# EAGLE board front-panel-controller (EAGLE 5.11)
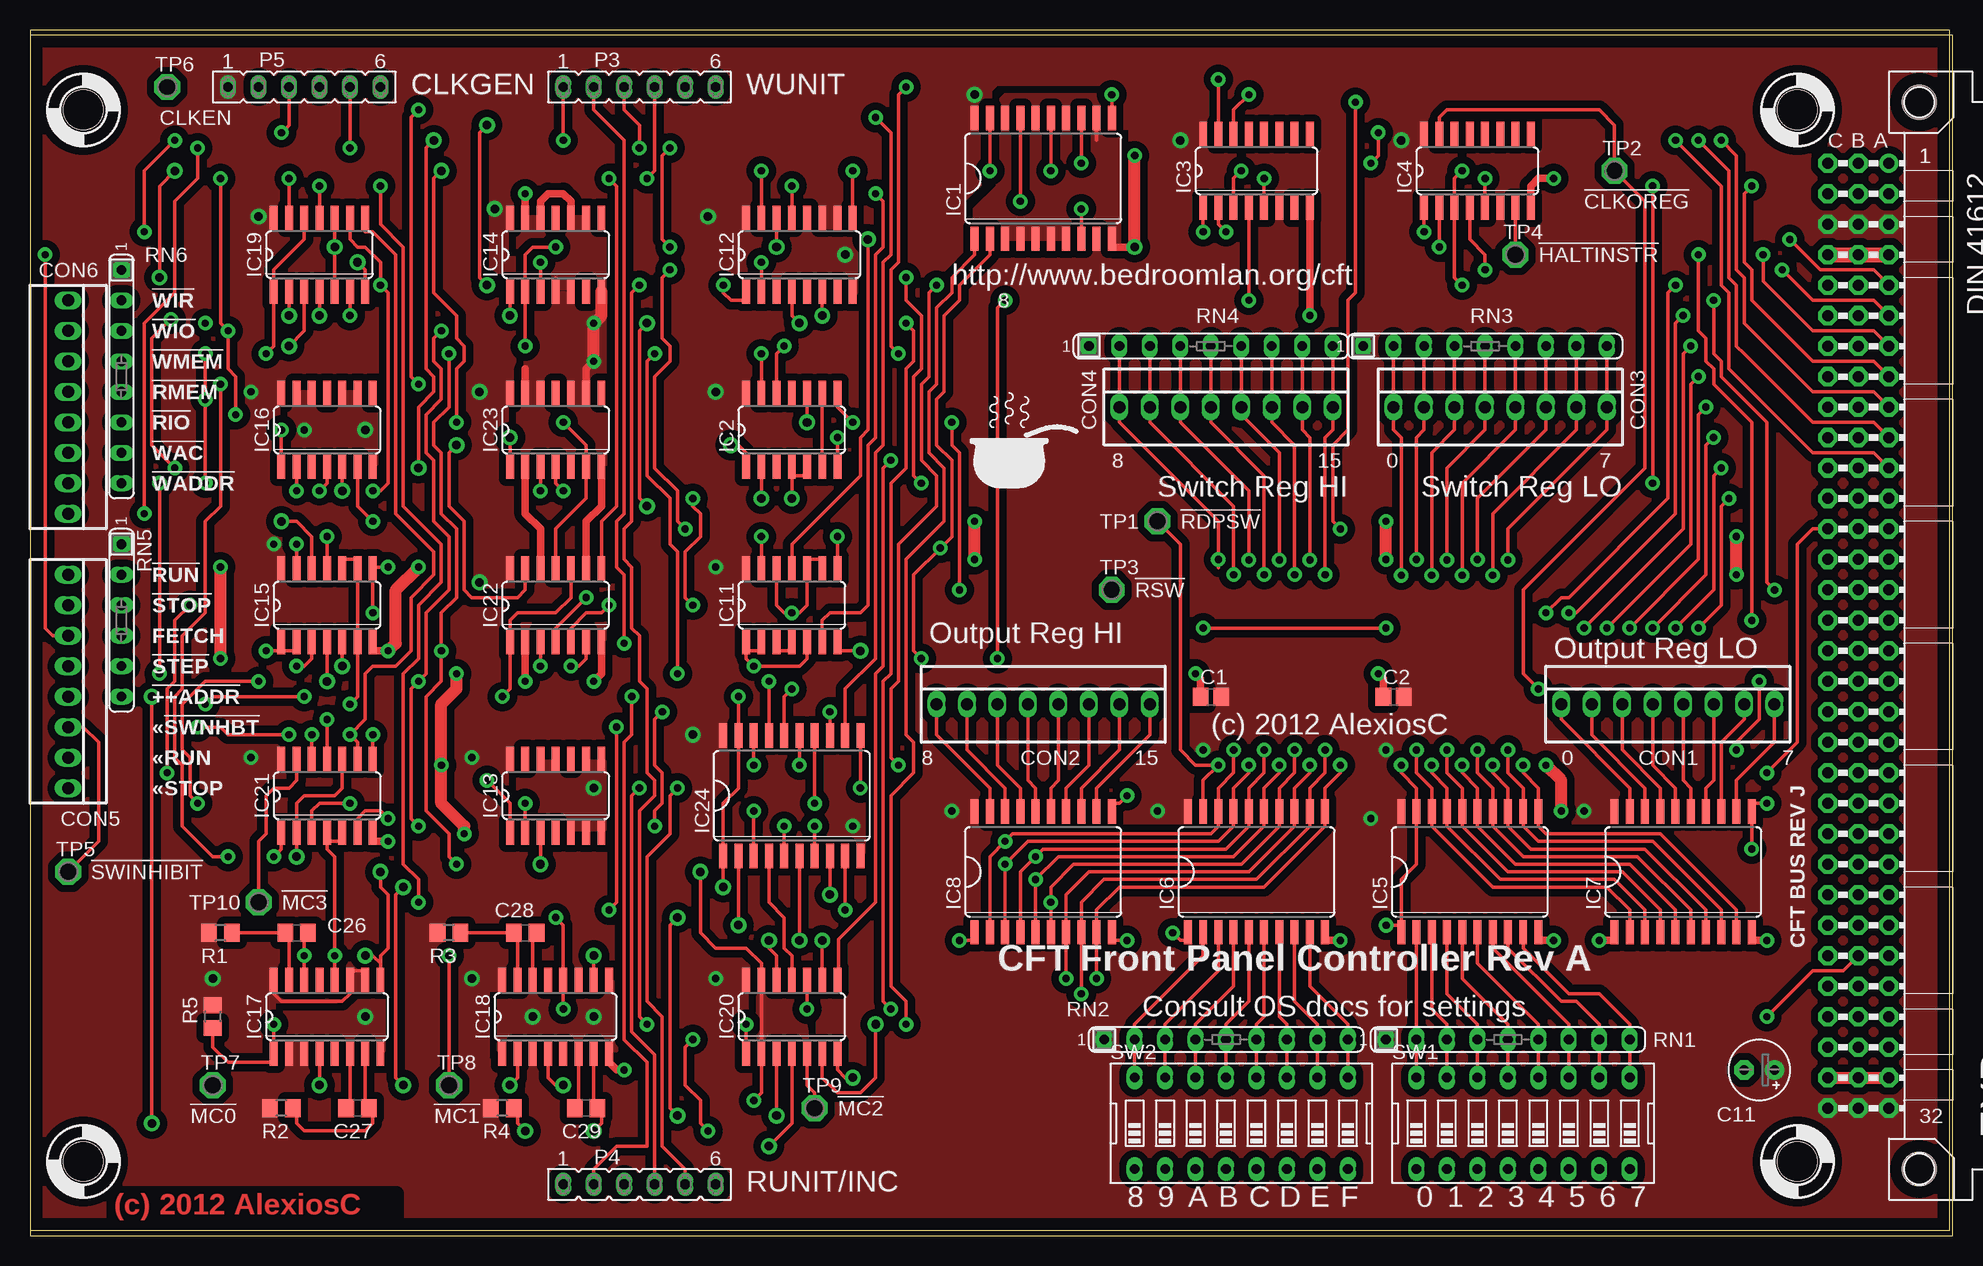
[diagram p4: board, top side]
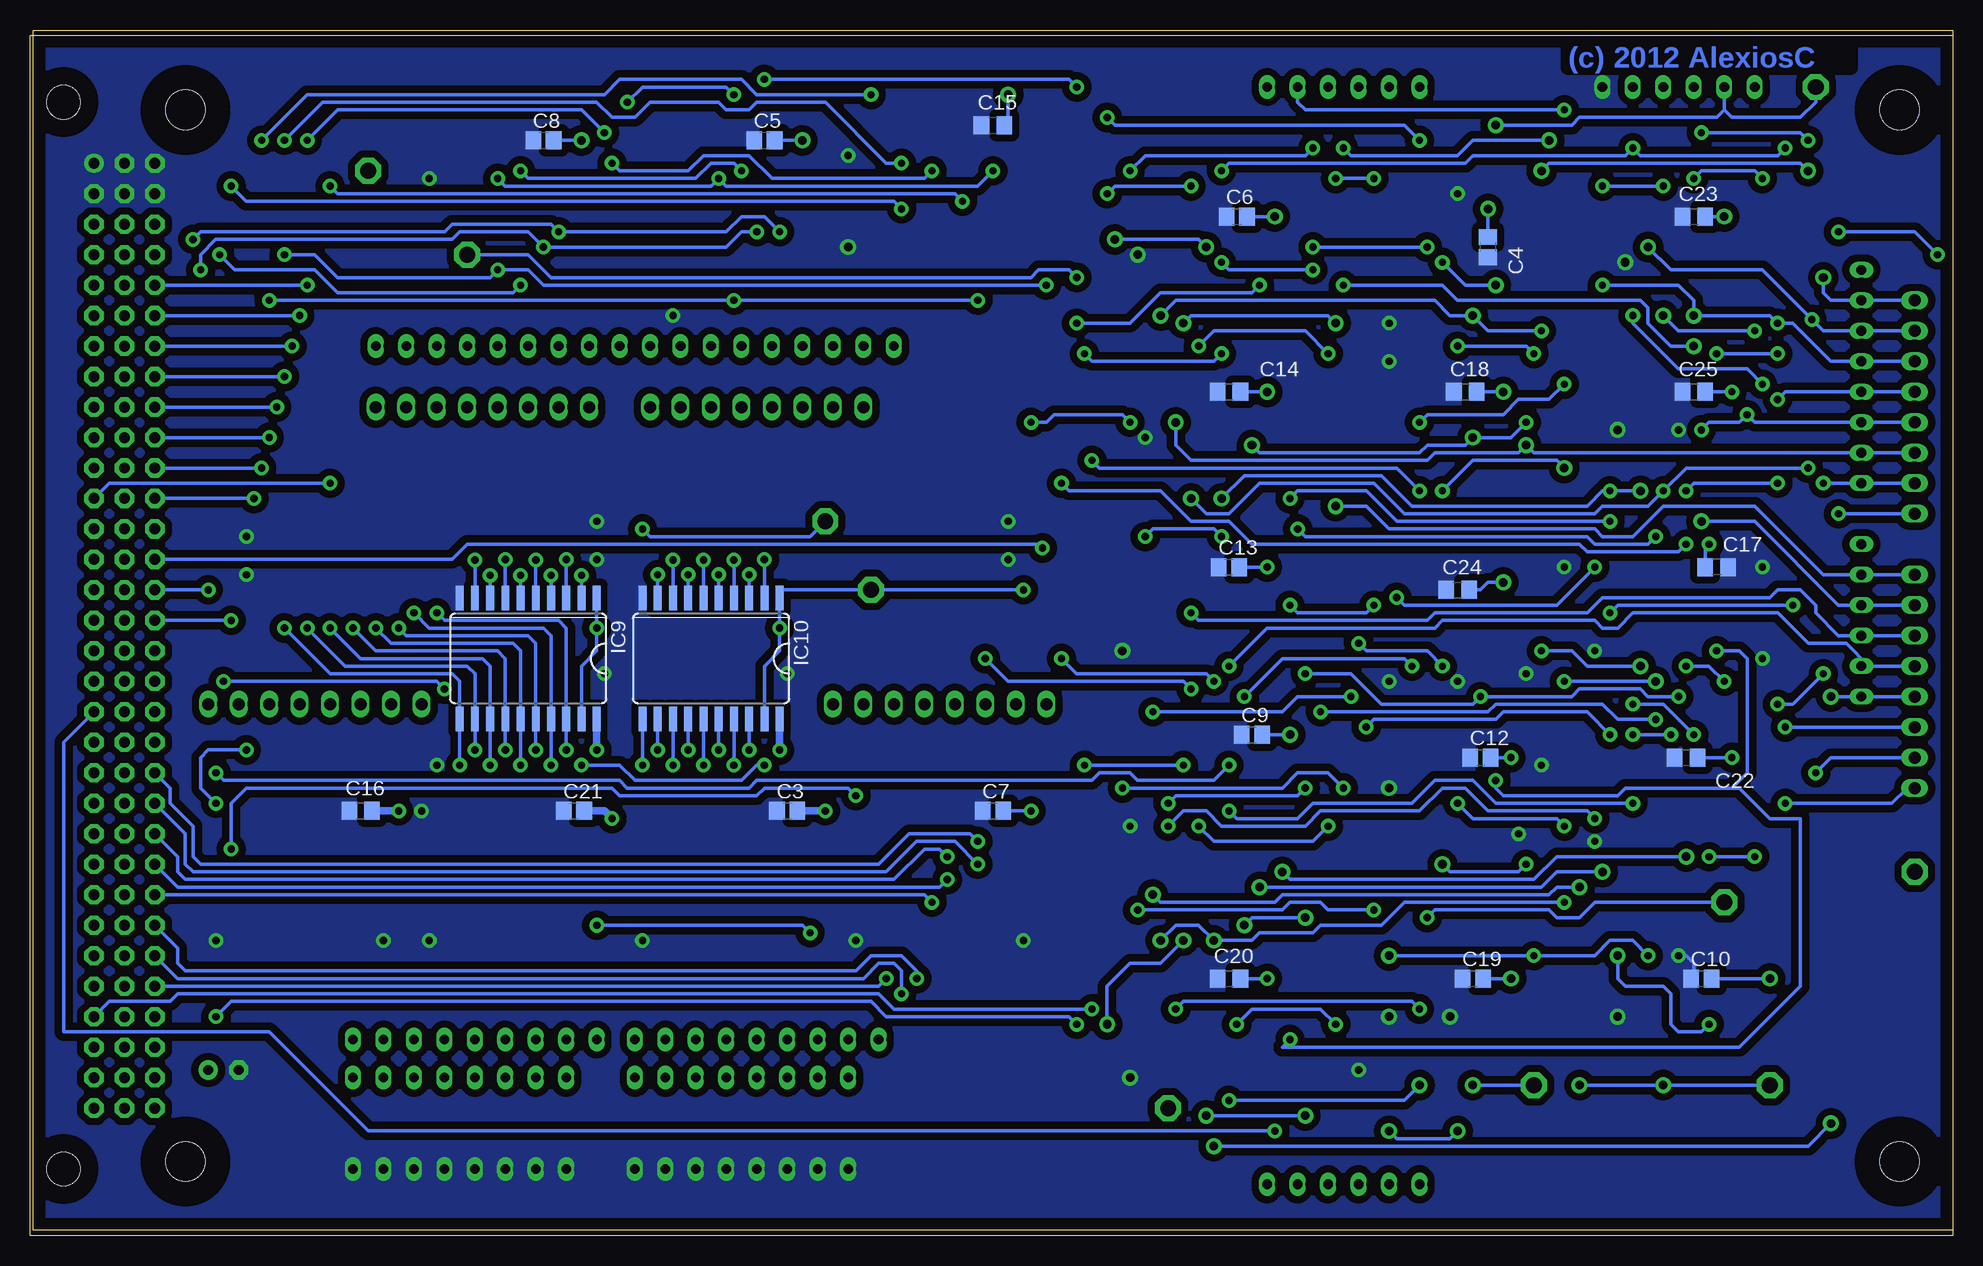
[diagram p5: board, bottom side, seen from below]

Size 160 x 100 mm. Coordinates in mm from the lower left corner, seen from the top.
Outline: 0,0 160,0 160,100 0,100 0,0
Copper layers (1*16): Top 0.035mm / dielectric 1.5mm / Bottom 0.035mm
Design rules "cft-olimex-10mil-small-pads-tented-vias": minimum track width 10mil, minimum drill 24mil, track to track 10mil, track to pad 10mil, pad to pad 10mil, via to via 10mil, smd to smd 10mil, copper to edge 40mil, drill to drill 10mil, minimum pad ring 10mil, minimum via ring 12mil, stop-mask expansion 4mil, vias tented up to drill 30mil, thermal gap 10mil
Net classes: 0 default: width 0.305 mm, clearance 0.254 mm; 1 Power: width 0.635 mm, clearance 0.254 mm; 2 12V: width 0.635 mm, clearance 0.635 mm

## Footprints (pad centres in the part's own frame; a part is rotated, then mirrored left to right if it is on the bottom)
C0805 = smd 1.3 x 1.5: 1 -0.85,0; 2 0.85,0
E2,5-5 = drill 0.813 pad 1.6 round: + -1.27,0 | drill 0.813 pad 1.6 octagon: - 1.27,0
C0805' = smd 1.3 x 1.5: 1 -0.95,0; 2 0.95,0
22-23-2081 = drill 1 long: 1 -8.89,0; 2 -6.35,0; 3 -3.81,0; 4 -1.27,0; 5 1.27,0; 6 3.81,0; 7 6.35,0; 8 8.89,0
VG96K = drill 0.914 pad 1.6 round: A1 154.94,39.37 | drill 0.914 pad 1.6 octagon: A2 154.94,36.83; A3 154.94,34.29; A4 154.94,31.75; A5 154.94,29.21; A6 154.94,26.67; A7 154.94,24.13; A8 154.94,21.59; A9 154.94,19.05; A10 154.94,16.51; A11 154.94,13.97; A12 154.94,11.43; A13 154.94,8.89; A14 154.94,6.35; A15 154.94,3.81; A16 154.94,1.27; A17 154.94,-1.27; A18 154.94,-3.81; A19 154.94,-6.35; A20 154.94,-8.89; A21 154.94,-11.43; A22 154.94,-13.97; A23 154.94,-16.51; A24 154.94,-19.05; A25 154.94,-21.59; A26 154.94,-24.13; A27 154.94,-26.67; A28 154.94,-29.21; A29 154.94,-31.75; A30 154.94,-34.29; A31 154.94,-36.83; A32 154.94,-39.37; B1 152.4,39.37; B2 152.4,36.83; B3 152.4,34.29; B4 152.4,31.75; B5 152.4,29.21; B6 152.4,26.67; B7 152.4,24.13; B8 152.4,21.59; B9 152.4,19.05; B10 152.4,16.51; B11 152.4,13.97; B12 152.4,11.43; B13 152.4,8.89; B14 152.4,6.35; B15 152.4,3.81; B16 152.4,1.27; B17 152.4,-1.27; B18 152.4,-3.81; B19 152.4,-6.35; B20 152.4,-8.89; B21 152.4,-11.43; B22 152.4,-13.97; B23 152.4,-16.51; B24 152.4,-19.05; B25 152.4,-21.59; B26 152.4,-24.13; B27 152.4,-26.67; B28 152.4,-29.21; B29 152.4,-31.75; B30 152.4,-34.29; B31 152.4,-36.83; B32 152.4,-39.37; C1 149.86,39.37; C2 149.86,36.83; C3 149.86,34.29; C4 149.86,31.75; C5 149.86,29.21; C6 149.86,26.67; C7 149.86,24.13; C8 149.86,21.59; C9 149.86,19.05; C10 149.86,16.51; C11 149.86,13.97; C12 149.86,11.43; C13 149.86,8.89; C14 149.86,6.35; C15 149.86,3.81; C16 149.86,1.27; C17 149.86,-1.27; C18 149.86,-3.81; C19 149.86,-6.35; C20 149.86,-8.89; C21 149.86,-11.43; C22 149.86,-13.97; C23 149.86,-16.51; C24 149.86,-19.05; C25 149.86,-21.59; C26 149.86,-24.13; C27 149.86,-26.67; C28 149.86,-29.21; C29 149.86,-31.75; C30 149.86,-34.29; C31 149.86,-36.83; C32 149.86,-39.37 | hole 2.794: 157.48,44.45; 157.48,-44.45
STANDOFF_28_60 = hole 3.302: 0,0
SO20W = smd 0.66 x 2.032: 1 -5.715,-5.029; 2 -4.445,-5.029; 3 -3.175,-5.029; 4 -1.905,-5.029; 5 -0.635,-5.029; 6 0.635,-5.029; 7 1.905,-5.029; 8 3.175,-5.029; 9 4.445,-5.029; 10 5.715,-5.029; 11 5.715,5.029; 12 4.445,5.029; 13 3.175,5.029; 14 1.905,5.029; 15 0.635,5.029; 16 -0.635,5.029; 17 -1.905,5.029; 18 -3.175,5.029; 19 -4.445,5.029; 20 -5.715,5.029
SO14 = smd 0.66 x 2.032: 1 -3.81,-3.073; 2 -2.54,-3.073; 3 -1.27,-3.073; 4 0,-3.073; 5 1.27,-3.073; 6 2.54,-3.073; 7 3.81,-3.073; 8 3.81,3.073; 9 2.54,3.073; 10 1.27,3.073; 11 0,3.073; 12 -1.27,3.073; 13 -2.54,3.073; 14 -3.81,3.073
SO16 = smd 0.66 x 2.032: 1 -4.445,-3.073; 2 -3.175,-3.073; 3 -1.905,-3.073; 4 -0.635,-3.073; 5 0.635,-3.073; 6 1.905,-3.073; 7 3.175,-3.073; 8 4.445,-3.073; 9 4.445,3.073; 10 3.175,3.073; 11 1.905,3.073; 12 0.635,3.073; 13 -0.635,3.073; 14 -1.905,3.073; 15 -3.175,3.073; 16 -4.445,3.073
FE06 = drill 0.813 long: 1 -6.35,0; 2 -3.81,0; 3 -1.27,0; 4 1.27,0; 5 3.81,0; 6 6.35,0
R0805 = smd 1.3 x 1.5: 1 -0.95,0; 2 0.95,0
SIL9 = drill 0.813 long: 1 -10.16,0; 2 -7.62,0; 3 -5.08,0; 4 -2.54,0; 5 0,0; 6 2.54,0; 7 5.08,0; 8 7.62,0; 9 10.16,0
SIL6 = drill 0.813 long: 1 -6.35,0; 2 -3.81,0; 3 -1.27,0; 4 1.27,0; 5 3.81,0; 6 6.35,0
SIL8 = drill 0.813 long: 1 -8.89,0; 2 -6.35,0; 3 -3.81,0; 4 -1.27,0; 5 1.27,0; 6 3.81,0; 7 6.35,0; 8 8.89,0
EDG-08 = drill 0.813 long: 1 -8.89,-3.81; 2 -6.35,-3.81; 3 -3.81,-3.81; 4 -1.27,-3.81; 5 1.27,-3.81; 6 3.81,-3.81; 7 6.35,-3.81; 8 8.89,-3.81; 9 8.89,3.81; 10 6.35,3.81; 11 3.81,3.81; 12 1.27,3.81; 13 -1.27,3.81; 14 -3.81,3.81; 15 -6.35,3.81; 16 -8.89,3.81
P1-13 = drill 1.321 pad 2.159 octagon: TP 0,0

## Placement (x,y rotation side)
C1  100nF  [C0805]  98.42,44.45 0 top
C2  100nF  [C0805]  113.67,44.45 0 top
C3  100nF  [C0805]  97.16,34.92 0 bottom
C4  100nF  [C0805]  38.73,81.92 90 bottom
C5  100nF  [C0805]  99.06,90.81 0 bottom
C6  100nF  [C0805]  59.69,84.45 0 bottom
C7  100nF  [C0805]  80.01,34.92 0 bottom
C8  100nF  [C0805]  117.47,90.81 0 bottom
C9  100nF  [C0805]  58.42,41.27 0 bottom
C10  100nF  [C0805]  20.95,20.95 0 bottom
C11  1uF  [E2,5-5]  144.15,13.34 180 top
C12  100nF  [C0805]  39.37,39.37 0 bottom
C13  100nF  [C0805]  60.33,55.24 0 bottom
C14  100nF  [C0805']  60.33,69.85 0 bottom
C15  100nF  [C0805']  80.01,92.08 0 bottom
C16  100nF  [C0805']  132.72,34.92 0 bottom
C17  100nF  [C0805']  19.68,55.24 180 bottom
C18  100nF  [C0805']  40.64,69.85 0 bottom
C19  100nF  [C0805]  40.01,20.95 0 bottom
C20  100nF  [C0805']  60.33,20.95 0 bottom
C21  100nF  [C0805]  114.94,34.92 0 bottom
C22  100nF  [C0805']  22.23,39.37 0 bottom
C23  100nF  [C0805']  21.59,84.45 0 bottom
C24  100nF  [C0805']  41.27,53.34 0 bottom
C25  100nF  [C0805']  21.59,69.85 0 bottom
C26  100nF  [C0805']  22.23,24.77 0 top
C27  100nF  [C0805']  27.3,10.16 180 top
C28  100nF  [C0805']  41.27,24.77 0 top
C29  100nF  [C0805']  46.35,10.16 180 top
CON1  22-23-2081  [22-23-2081]  136.53,43.81 0 top
CON2  22-23-2081  [22-23-2081]  84.45,43.81 0 top
CON3  22-23-2081  [22-23-2081]  122.56,68.58 0 top
CON4  22-23-2081  [22-23-2081]  99.69,68.58 0 top
CON5  22-23-2081  [22-23-2081]  3.17,45.72 270 top
CON6  22-23-2081  [22-23-2081]  3.17,68.58 270 top
EXP  [VG96K]  0,49.53 0 top
H1  HOLE  [STANDOFF_28_60]  147.32,93.34 0 top
H2  HOLE  [STANDOFF_28_60]  147.32,5.71 0 top
H3  HOLE  [STANDOFF_28_60]  4.45,5.71 0 top
H4  HOLE  [STANDOFF_28_60]  4.45,93.34 0 top
IC1  74HC688DW  [SO20W]  84.45,87.63 0 top
IC2  74HC21D  [SO14]  63.5,66.67 0 top
IC3  74HC138D  [SO16]  102.23,88.27 0 top
IC4  74HC138D  [SO16]  120.65,88.27 0 top
IC5  74HC541DW  [SO20W]  120.02,29.84 0 top
IC6  74HC541DW  [SO20W]  102.23,29.84 0 top
IC7  74HCT574D  [SO20W]  137.79,29.84 0 top
IC8  74HCT574D  [SO20W]  84.45,29.84 0 top
IC9  74HC541DW  [SO20W]  118.75,47.62 180 bottom
IC10  74HC541DW  [SO20W]  103.5,47.62 180 bottom
IC11  74HC00D  [SO14]  63.5,52.07 0 top
IC12  74HC112D  [SO16]  64.14,81.28 0 top
IC13  74HC01D  [SO14]  43.81,36.2 0 top
IC14  74HC00D  [SO14]  43.81,81.28 0 top
IC15  74HC00D  [SO14]  24.77,52.07 0 top
IC16  74HC21D  [SO14]  24.77,66.67 0 top
IC17  74LS123D  [SO16]  24.77,17.78 0 top
IC18  74LS123D  [SO16]  43.81,17.78 0 top
IC19  74HC08D  [SO14]  24.13,81.28 0 top
IC20  74HCT32D  [SO14]  63.5,17.78 0 top
IC21  74HCT32D  [SO14]  24.77,36.2 0 top
IC22  74HC125D  [SO14]  43.81,52.07 0 top
IC23  74HC125D  [SO14]  43.81,66.67 0 top
IC24  74HCT541DW  [SO20W]  63.5,36.2 0 top
P3  [FE06]  50.8,95.25 0 top
P4  [FE06]  50.8,3.81 0 top
P5  [FE06]  22.86,95.25 0 top
R1  1k  [R0805]  15.88,24.77 180 top
R2  4k7  [R0805]  20.95,10.16 180 top
R3  4k7  [R0805]  34.92,24.77 180 top
R4  1k  [R0805]  39.37,10.16 180 top
R5  2k2  [R0805]  15.24,17.78 90 top
RN1  2k2  [SIL9]  123.19,15.88 0 top
RN2  2k2  [SIL9]  99.69,15.88 0 top
RN3  2k2  [SIL9]  121.28,73.66 0 top
RN4  2k2  [SIL9]  98.42,73.66 0 top
RN5  2k2  [SIL6]  7.62,50.8 270 top
RN6  2k2  [SIL8]  7.62,71.12 270 top
SW1  [EDG-08]  124.46,8.89 0 top
SW2  [EDG-08]  100.97,8.89 0 top
TP1  TPPAD1-13  [P1-13]  93.98,59.05 0 top
TP2  TPPAD1-13  [P1-13]  132.08,88.27 0 top
TP3  TPPAD1-13  [P1-13]  90.17,53.34 0 top
TP4  TPPAD1-13  [P1-13]  123.83,81.28 0 top
TP5  TPPAD1-13  [P1-13]  3.17,29.84 0 top
TP6  TPPAD1-13  [P1-13]  11.43,95.25 0 top
TP7  TPPAD1-13  [P1-13]  15.24,12.06 0 top
TP8  TPPAD1-13  [P1-13]  34.92,12.06 0 top
TP9  TPPAD1-13  [P1-13]  65.41,10.16 0 top
TP10  TPPAD1-13  [P1-13]  19.05,27.3 0 top
U$1  SIGNATURESILK  [SIGNATURE]  78.74,61.59 0 top

## Tracks (layer width: path | path; a pad name or v marks a point on that pad's centre or on a via)
!CLKOREG  (via drill 0.6, 0.61)
  Top 0.305: v125.73,45.09 124.46,46.35 124.46,53.34 134.62,63.5 134.62,85.72 TP2.TP 132.08,92.08 130.81,93.34 118.11,93.34 117.47,92.71 IC4.15 | v143.51,31.75 IC7.11 143.51,35.56 v144.78,35.56 | v91.44,36.2 90.81,35.56 90.17,35.56 IC8.11 | v144.15,45.72 144.15,42.55 142.24,40.64 v142.24,40.01
  Bottom 0.305: v125.73,45.09 126.36,45.72 v144.15,45.72 | v143.51,31.75 143.51,35.56 142.24,36.83 111.76,36.83 111.12,36.2 99.69,36.2 99.06,36.83 92.08,36.83 v91.44,36.2 | v142.24,40.01 145.41,40.01 146.05,39.37 146.05,36.83 v144.78,35.56
!FPINCADDR  (via drill 0.71)
  Top 0.305: v10.16,8.89 v10.16,44.45 | IC20.4 63.5,8.89 v61.59,6.99
  Bottom 0.305: CON5.5 RN5.6 v10.16,44.45 | v61.59,6.99 12.06,6.99 v10.16,8.89
!FPIO  (via drill 0.6)
  Top 0.305: IC21.1 20.95,31.75 v20.32,31.11 | v26.67,76.2 IC19.6 | v15.88,70.48 15.88,60.33 14.61,59.05 14.61,51.44 12.7,49.53 12.7,45.09 12.06,44.45 12.06,39.37 12.7,38.73 12.7,33.66 15.24,31.11 v16.51,31.11
  Bottom 0.305: v16.51,31.11 v20.32,31.11 | v15.88,70.48 17.14,71.75 22.86,71.75 26.67,75.56 v26.67,76.2
!FPMEM  (via drill 0.6, 0.71)
  Top 0.305: v21.59,73.66 22.86,74.93 IC19.3 | v59.69,17.14 IC20.1 | v51.44,17.14 50.8,17.78 50.8,34.92 52.07,36.2 52.07,37.47 51.44,38.1 51.44,45.09 50.8,45.72 50.8,49.53 50.16,50.16 50.16,55.24 49.53,55.88 49.53,58.42 50.16,59.05 50.16,78.11 v50.8,78.74
  Bottom 0.305: v51.44,17.14 52.7,18.41 58.42,18.41 v59.69,17.14 | v21.59,73.66 23.5,73.66 25.4,75.56 25.4,76.83 26.04,77.47 41.27,77.47 42.55,78.74 v50.8,78.74
!FPR  (via drill 0.6, 0.71)
  Top 0.305: v66.04,24.13 IC20.9 | IC20.12 62.23,22.86 61.59,23.5 v61.59,24.13 | v24.13,87 IC19.11 | v29.21,87 29.21,83.82 31.11,81.92 31.11,60.33 34.29,57.15 34.29,53.98 32.38,52.07 32.38,47.62 31.11,46.35 31.11,30.48 32.38,29.21 v32.38,27.3
  Bottom 0.305: v66.04,24.13 64.77,25.4 62.87,25.4 v61.59,24.13 58.42,24.13 57.78,24.77 53.34,24.77 52.7,25.4 47.62,25.4 45.72,27.3 v32.38,27.3 | v29.21,87 v24.13,87
!FPRIO  (via drill 0.6, 0.71)
  Top 0.305: v24.13,76.2 IC19.4 | 20.95,62.87 IC16.1 v20.95,66.67 | v17.14,67.94 17.14,71.12 16.51,71.75 v16.51,74.93 15.88,75.56 v15.88,87.63 | v21.59,87.63 IC19.13
  Bottom 0.305: CON6.5 RN6.6 16.51,67.31 v17.14,67.94 17.78,67.31 20.32,67.31 v20.95,66.67 | v15.88,87.63 16.51,88.27 20.95,88.27 v21.59,87.63 | v16.51,74.93 22.86,74.93 v24.13,76.2
!FPRMEM  (via drill 0.6)
  Top 0.305: IC19.12 22.86,82.55 20.32,80.01 IC19.1 20.32,73.66 v19.68,73.03 | v14.61,73.03 v14.61,69.22 v14.61,62.23 | v22.23,61.59 IC16.2
  Bottom 0.305: CON6.4 RN6.5 13.97,69.85 v14.61,69.22 | v14.61,73.03 v19.68,73.03 | v14.61,62.23 21.59,62.23 v22.23,61.59
!FPRUN  (via drill 0.71)
  Top 0.305: v51.44,60.33 50.8,60.96 50.8,74.93 v51.44,75.56 | v64.14,75.56 63.5,76.2 IC12.4
  Bottom 0.305: CON5.1 RN5.2 10.79,54.61 16.51,60.33 24.13,60.33 26.67,57.78 29.21,57.78 29.84,58.42 46.99,58.42 48.9,60.33 v51.44,60.33 | v51.44,75.56 52.07,76.2 63.5,76.2 v64.14,75.56
!FPSTEP  (via drill 0.6)
  Top 0.305: 59.69,48.26 59.69,47.62 v60.33,46.99 64.14,46.99 64.77,47.62 IC11.5 | 59.69,48.26 IC11.1 | 59.69,48.26 60.96,48.26 IC11.2
  Bottom 0.305: CON5.4 6.99,46.99 | v60.33,46.99 57.15,50.16 43.18,50.16 42.55,50.8 29.84,50.8 29.21,50.16 27.94,50.16 26.67,51.44 14.61,51.44 12.06,48.9 8.89,48.9 6.99,46.99 | 6.99,46.99 RN5.5
!FPSTOP  (via drill 0.71)
  Top 0.305: v20.95,59.05 22.23,59.05 23.5,57.78 IC15.12
  Bottom 0.305: CON5.2 RN5.3 9.53,52.07 16.51,59.05 v20.95,59.05
!FPW  (via drill 0.6)
  Top 0.305: IC21.9 27.3,40.64 v26.67,41.27 27.94,42.55 27.94,46.35 28.57,46.99 30.48,46.99 31.75,48.26 31.75,52.7 33.66,54.61 33.66,56.52 30.48,59.69 30.48,81.28 28.57,83.19 27.94,83.19 IC19.8 27.94,85.09 | IC21.12 v23.5,41.27
  Bottom 0.305: v23.5,41.27 v26.67,41.27
!FPWAC  (via drill 0.71)
  Top 0.305: v64.77,67.31 IC2.10 | v35.56,65.41 34.92,64.77 34.92,60.33 36.2,59.05 36.2,53.34 36.83,52.7 40.64,52.7 41.27,53.34 IC22.13
  Bottom 0.305: CON6.6 RN6.7 34.92,64.77 v35.56,65.41 36.2,64.77 43.18,64.77 43.81,64.14 63.5,64.14 64.77,65.41 v64.77,67.31
!FPWADDR  (via drill 0.6)
  Top 0.305: v10.79,46.35 v10.79,62.23 | v39.37,44.45 40.01,45.09 IC22.1 40.01,50.8 40.64,51.44 43.81,51.44 45.09,52.7 IC22.10 | IC2.12 62.23,73.03 v62.87,73.66 | v52.07,73.03 51.44,72.39 51.44,62.87 53.34,60.96 53.34,57.15 53.98,56.52 v53.98,46.35 | v14.61,43.81 15.24,44.45 v22.86,44.45
  Bottom 0.305: CON6.7 RN6.8 v10.79,62.23 | v52.07,73.03 53.98,74.93 61.59,74.93 v62.87,73.66 | v53.98,46.35 50.16,46.35 47.62,43.81 40.01,43.81 v39.37,44.45 31.75,44.45 31.11,45.09 26.04,45.09 25.4,44.45 v22.86,44.45 | v10.79,46.35 13.34,43.81 v14.61,43.81
!FPWIO  (via drill 0.6, 0.71)
  Top 0.305: IC19.10 v25.4,81.92 IC19.5 | v63.5,60.96 63.5,62.87 | IC16.4 24.77,62.23 v24.13,61.59 | v12.06,63.5 10.16,65.41 10.16,74.3 v11.75,75.88 | 63.5,62.87 IC2.4 | 63.5,62.87 64.77,62.87 IC2.5
  Bottom 0.305: CON6.2 RN6.3 10.79,74.93 v11.75,75.88 15.88,80.01 23.5,80.01 v25.4,81.92 | v63.5,60.96 62.23,59.69 60.33,59.69 57.78,62.23 48.26,62.23 45.72,59.69 29.84,59.69 29.21,60.33 25.4,60.33 v24.13,61.59 22.23,63.5 v12.06,63.5
!FPWIR  (via drill 0.6, 0.71)
  Top 0.305: v40.01,66.04 IC23.1 | IC2.1 59.69,64.77 59.05,65.41 v58.42,65.41 | v10.79,79.38 10.79,87 v12.06,88.27 | v34.29,88.27 33.66,87.63 33.66,78.11 35.56,76.2 35.56,74.3 36.2,73.66 36.2,72.39 35.56,71.75 v35.56,67.31
  Bottom 0.305: CON6.1 RN6.2 10.16,77.47 10.79,78.11 v10.79,79.38 | v12.06,88.27 12.7,88.9 33.66,88.9 v34.29,88.27 | v35.56,67.31 36.83,66.04 v40.01,66.04 40.64,65.41 43.81,65.41 44.45,64.77 57.78,64.77 v58.42,65.41
!FPWMEM  (via drill 0.6, 0.71)
  Top 0.305: v26.04,61.59 IC16.5 | v60.96,60.96 IC2.2 | v21.59,76.2 IC19.2 | v28.57,61.59 29.21,61.59 29.84,62.23 29.84,78.11 v29.21,78.74 29.21,80.64 27.94,81.92 27.3,81.92 26.67,82.55 IC19.9
  Bottom 0.305: CON6.3 RN6.4 10.16,72.39 13.34,75.56 v14.61,75.56 15.24,76.2 v21.59,76.2 21.59,77.47 22.86,78.74 v29.21,78.74 | v26.04,61.59 v28.57,61.59 29.21,61.59 30.48,60.33 45.09,60.33 47.62,62.87 59.05,62.87 v60.96,60.96
!HALT  (via drill 0.6)
  Top 0.305: 20.95,48.26 22.23,48.26 IC15.2 | v38.1,37.47 40.01,35.56 IC13.1 | 20.95,48.26 IC15.1 | v19.68,48.26 20.95,48.26 | v55.24,15.88 54.61,15.24 54.61,12.06 55.88,10.79 55.88,8.89 v56.52,8.26
  Bottom 0.305: v38.1,37.47 38.1,36.83 37.47,36.2 27.94,36.2 27.3,36.83 18.41,36.83 | 18.41,36.83 17.14,38.1 17.14,47.62 17.78,48.26 v19.68,48.26 | EXP.A19 157.48,40.64 157.48,16.51 140.34,16.51 132.08,8.26 v56.52,8.26 | 18.41,36.83 17.78,36.83 15.24,34.29 12.7,34.29 12.7,20.32 17.78,15.24 55.88,15.24 v55.24,15.88
!HALTINSTR  (via drill 0.6)
  Top 0.305: IC15.13 v22.23,57.15 | v74.3,62.23 73.66,62.87 73.66,71.12 74.3,71.75 74.3,76.2 73.03,77.47 v73.03,79.38 | TP4.TP IC4.7
  Bottom 0.305: v22.23,57.15 22.86,56.52 30.48,56.52 31.11,57.15 58.42,57.15 60.33,59.05 63.5,59.05 66.04,61.59 73.66,61.59 v74.3,62.23 | TP4.TP 118.75,81.28 116.84,79.38 76.83,79.38 76.2,80.01 73.66,80.01 v73.03,79.38
!INCPC  (via drill 0.6)
  Top 0.305: v65.41,35.56 IC24.14 | v53.98,36.83 53.34,36.2 53.34,33.02 51.44,31.11 51.44,19.05 52.7,17.78 52.7,6.99 54.61,5.08 P4.5
  Bottom 0.305: v53.98,36.83 54.61,36.2 64.77,36.2 v65.41,35.56
!IO  (via drill 0.6)
  Top 0.305: IC24.17 v61.59,45.72 | IC1.2 80.01,81.28 77.47,78.74 77.47,77.47 76.2,76.2 76.2,69.85 75.56,69.22 75.56,65.41 76.83,64.14 76.83,57.78 v75.88,56.83 73.66,54.61 73.66,48.26 v74.3,47.62
  Bottom 0.305: v61.59,45.72 62.23,46.35 73.03,46.35 v74.3,47.62 | EXP.C14 125.09,55.88 123.83,57.15 76.2,57.15 v75.88,56.83
!MC0  (via drill 0.71)
  Top 0.305: v24.13,12.06 IC17.4 | v31.11,12.06 30.48,12.7 30.48,27.94 v31.11,28.57 | v66.67,27.94 IC24.8
  Bottom 0.305: v31.11,12.06 v24.13,12.06 TP7.TP | v31.11,28.57 33.02,28.57 33.66,27.94 55.88,27.94 56.52,27.3 66.04,27.3 v66.67,27.94
!MC1  (via drill 0.6, 0.71)
  Top 0.305: IC21.5 26.04,32.38 24.77,32.38 | 24.77,32.38 IC21.4 | v46.99,22.86 IC18.10 | v40.01,12.06 40.64,12.7 IC18.2 | TP8.TP v34.92,22.86 | 24.77,32.38 24.77,31.75 25.4,31.11 v25.4,22.86 IC17.12
  Bottom 0.305: v25.4,22.86 26.67,24.13 28.57,24.13 29.84,22.86 v34.92,22.86 v46.99,22.86 | TP8.TP v40.01,12.06
!MC2  (via drill 0.6, 0.71)
  Top 0.305: v60.33,10.79 60.96,11.43 IC20.2 IC20.13 60.96,22.23 59.69,23.5 57.15,23.5 55.88,24.77 v55.88,29.84 | v44.45,12.06 43.81,12.06 43.18,12.7 IC18.4 | v22.23,31.11 IC21.2 22.23,35.56 22.86,36.2 25.4,36.2 26.04,36.83 IC21.10 | TP9.TP 65.41,11.43 64.77,12.06 IC20.5
  Bottom 0.305: v60.33,10.79 45.72,10.79 v44.45,12.06 | v22.23,31.11 33.02,31.11 34.92,29.21 55.24,29.21 v55.88,29.84
  pour Top (isolate 0.61, rank 5, no thermals): 60.64,19.68 60.64,14.61 64.77,14.61 64.77,16.51 64.14,19.68
!MC3  (via drill 0.6)
  Top 0.305: v44.45,18.41 IC18.12 44.45,25.4 v43.81,26.04 | v64.77,18.41 IC20.10 | TP10.TP 19.05,32.38 19.68,33.02 19.68,36.2 20.32,36.83 21.59,36.83 22.23,37.47 IC21.13
  Bottom 0.305: v44.45,18.41 45.09,19.05 64.14,19.05 v64.77,18.41 | TP10.TP 29.84,27.3 31.11,26.04 33.02,26.04 33.66,26.67 43.18,26.67 v43.81,26.04
!MCSTART  (via drill 0.6, 0.71)
  Top 0.305: v57.78,28.57 IC24.1 57.78,35.56 59.05,36.83 IC24.19 v59.05,44.45 | 29.21,22.23 IC17.9 | v27.94,22.86 28.57,22.86 29.21,22.23 | 29.21,22.23 29.21,22.86 29.84,23.5 29.84,27.94 29.21,28.57 v29.21,29.84 | v20.32,17.14 IC17.1 20.32,13.97 16.51,13.97 15.24,15.24 R5.1 | v45.09,46.99 45.72,46.99 46.35,47.62 IC22.6
  Bottom 0.305: v29.21,29.84 33.02,29.84 34.29,28.57 v57.78,28.57 | v20.32,17.14 20.95,16.51 22.86,16.51 23.5,17.14 23.5,19.68 24.13,20.32 27.3,20.32 27.94,20.95 v27.94,22.86 | v59.05,44.45 55.88,47.62 45.72,47.62 v45.09,46.99
!MEM  (via drill 0.6)
  Top 0.305: v60.33,38.73 IC24.18 | v144.78,38.1 147.32,40.64 147.32,57.15 148.59,58.42 EXP.C13
  Bottom 0.305: v60.33,38.73 61.59,37.47 67.94,37.47 68.58,38.1 71.12,38.1 71.75,37.47 99.69,37.47 100.33,36.83 110.49,36.83 111.12,37.47 144.15,37.47 v144.78,38.1
!R  (via drill 0.6)
  Top 0.305: IC24.16 62.87,44.45 v63.5,45.09 | v80.64,47.62 80.64,76.83 v81.28,77.47 | v101.6,77.47 IC3.4 | v140.34,77.47 140.34,73.03 140.97,72.39 140.97,71.12 144.78,67.31 144.78,53.98 v145.41,53.34
  Bottom 0.305: v63.5,45.09 64.14,45.72 78.74,45.72 v80.64,47.62 | v81.28,77.47 v101.6,77.47 v140.34,77.47 | v145.41,53.34 EXP.C15
!RAC  (via drill 0.6)
  Top 0.305: v50.8,36.83 50.16,36.2 50.16,16.51 52.07,14.61 P4.4 | v69.22,36.83 IC24.11
  Bottom 0.305: v50.8,36.83 52.07,38.1 54.61,38.1 55.88,36.83 v69.22,36.83
!RDPSW  (via drill 0.6, 0.61)
  Top 0.305: IC6.1 96.52,24.13 95.89,24.13 v95.25,24.77 | 114.3,25.4 114.3,29.21 115.57,30.48 IC5.19 115.57,36.83 114.3,38.1 v114.3,38.73 | 100.33,91.44 IC3.14 100.33,93.34 v101.6,94.61 | v113.03,25.4 114.3,25.4 | 114.3,25.4 IC5.1 | v110.49,93.98 110.49,78.11 109.86,77.47 109.86,66.67 108.58,65.41 108.58,59.05 v109.22,58.42 | IC6.19 97.79,37.47 v99.06,38.73 97.16,38.73 95.89,40.01 95.89,57.15 TP1.TP
  Bottom 0.305: v113.03,25.4 95.89,25.4 v95.25,24.77 | v110.49,93.98 109.22,95.25 102.23,95.25 v101.6,94.61 | v109.22,58.42 108.58,57.78 95.25,57.78 TP1.TP | v99.06,38.73 99.69,38.73 100.97,37.47 109.86,37.47 111.12,38.73 v114.3,38.73
!RPC  (via drill 0.6)
  Top 0.305: v50.16,44.45 50.16,41.27 49.53,40.64 49.53,15.88 51.44,13.97 51.44,6.99 48.9,6.99 46.99,5.08 P4.2 | v66.67,43.18 IC24.13
  Bottom 0.305: v50.16,44.45 54.61,44.45 55.88,43.18 v66.67,43.18
!RSW  (via drill 0.6)
  Top 0.305: 67.31,70.48 IC2.8 67.31,68.58 v68.58,67.31 | v77.47,53.34 77.47,64.77 76.83,65.41 v76.83,67.31 | v97.79,50.16 v113.03,50.16
  Bottom 0.305: IC9.1 v113.03,50.16 113.03,48.26 114.3,46.99 IC9.19 | IC10.19 99.06,46.99 97.79,48.26 v97.79,50.16 IC10.1 97.79,53.34 TP3.TP v77.47,53.34 | v76.83,67.31 75.56,67.31 74.93,67.94 69.22,67.94 v68.58,67.31
!SWINHIBIT  (via drill 0.6)
  Top 0.305: IC15.10 26.04,55.88 27.3,55.88 IC15.9 IC15.6 27.3,44.45 v26.67,43.81 | v13.97,41.91 15.88,41.91 16.51,41.27 v21.59,41.27 | TP5.TP 5.71,32.38 5.71,40.64 4.45,41.91 CON5.6
  Bottom 0.305: v26.67,43.81 24.13,43.81 v21.59,41.27 | CON5.6 v13.97,41.91
!SYSDEV  (via drill 0.6)
  Top 0.305: EXP.B27 151.13,21.59 148.59,21.59 v144.78,17.78 | v73.03,17.14 73.03,19.05 71.75,20.32 71.75,36.2 73.66,38.1 73.66,40.64 73.03,41.27 73.03,55.88 76.2,59.05 76.2,63.5 74.93,64.77 74.93,69.85 75.56,70.48 75.56,76.83 76.83,78.11 76.83,79.38 78.74,81.28 IC1.1
  Bottom 0.305: v144.78,17.78 143.51,19.05 90.17,19.05 88.9,17.78 73.66,17.78 v73.03,17.14
!W  (via drill 0.6)
  Top 0.305: v143.51,50.8 143.51,67.31 140.34,70.48 140.34,71.75 139.7,72.39 139.7,74.3 139.06,74.93 v139.06,81.28 | v121.28,80.01 121.28,81.28 120.02,82.55 IC4.4 | v75.56,78.74 74.93,78.11 74.93,71.12 74.3,70.48 74.3,64.14 75.56,62.87 75.56,60.33 72.39,57.15 72.39,45.72 71.75,45.09 71.75,39.37 v72.39,38.73 | v64.14,38.73 IC24.15
  Bottom 0.305: v143.51,50.8 EXP.C16 | v75.56,78.74 117.47,78.74 118.75,80.01 v121.28,80.01 121.92,79.38 134.62,79.38 136.53,81.28 v139.06,81.28 | v64.14,38.73 v72.39,38.73
!WAC  (via drill 0.6)
  Top 0.305: v32.38,70.48 31.75,71.12 31.75,92.71 v32.38,93.34 | v44.45,67.31 46.35,65.41 IC23.6 46.35,60.96 43.81,58.42 IC22.11
  Bottom 0.305: v32.38,93.34 53.98,93.34 54.61,93.98 P3.5 | v32.38,70.48 33.66,69.22 36.2,69.22 37.47,67.94 43.81,67.94 v44.45,67.31
!WAR  (via drill 0.6)
  Top 0.305: v44.45,90.81 P3.1 | IC24.12 67.94,45.09 70.48,47.62 70.48,64.77 71.12,65.41 71.12,80.64 71.75,81.28 71.75,91.44 v70.48,92.71
  Bottom 0.305: v70.48,92.71 69.85,92.08 45.72,92.08 v44.45,90.81
!WDR  (via drill 0.6)
  Top 0.305: IC22.8 47.62,59.05 48.9,60.33 48.9,87 v48.26,87.63 | v51.44,87.63 52.07,88.27 P3.4
  Bottom 0.305: v48.26,87.63 v51.44,87.63
!WIR  (via drill 0.6, 0.71)
  Top 0.305: v33.66,90.81 33.02,90.17 33.02,71.75 33.66,71.12 33.66,69.85 32.38,68.58 v32.38,63.5 | v42.55,61.59 IC23.3 | v50.8,90.17 50.8,92.08 49.53,93.34 P3.3
  Bottom 0.305: v50.8,90.17 50.16,89.53 41.27,89.53 40.01,90.81 v33.66,90.81 | v32.38,63.5 33.02,64.14 40.01,64.14 v42.55,61.59
!WPC  (via drill 0.6)
  Top 0.305: P3.2 46.99,93.34 49.53,90.81 49.53,59.69 48.9,59.05 48.9,55.24 49.53,54.61 v49.53,48.9 | v42.55,46.99 IC22.3
  Bottom 0.305: v42.55,46.99 43.81,48.26 48.9,48.26 v49.53,48.9
+3.3V
  Top 1.27: EXP.C4 EXP.B4 EXP.A4
+12V
  Top 1.016: EXP.C31 EXP.B31 EXP.A31
AB0  (via drill 0.6)
  Top 0.305: v97.79,83.19 IC3.1 | v116.2,83.19 IC4.1 | EXP.A5 153.67,80.01 149.22,80.01 v146.69,82.55
  Bottom 0.305: v97.79,83.19 99.06,84.45 100.97,84.45 102.23,83.19 v116.2,83.19 116.84,83.82 125.09,83.82 125.73,83.19 146.05,83.19 v146.69,82.55
AB1  (via drill 0.6)
  Top 0.305: IC3.2 99.06,83.82 v99.69,83.19 | v117.47,81.92 IC4.2 | v146.05,80.01 148.59,77.47 153.67,77.47 EXP.A6
  Bottom 0.305: v99.69,83.19 100.97,83.19 102.23,81.92 v117.47,81.92 118.75,83.19 124.46,83.19 125.09,82.55 144.78,82.55 146.05,81.28 v146.05,80.01
AB2  (via drill 0.6)
  Top 0.305: EXP.A7 153.67,74.93 148.59,74.93 144.46,79.06 v144.46,81.28 | v119.38,78.74 118.75,79.38 IC4.3 118.75,87.63 v119.38,88.27 | IC3.3 100.33,87.63 v100.97,88.27
  Bottom 0.305: v100.97,88.27 101.6,88.9 103.5,88.9 104.78,87.63 118.75,87.63 v119.38,88.27 | v119.38,78.74 120.02,78.11 134.62,78.11 136.53,80.01 143.19,80.01 v144.46,81.28
AB3  (via drill 0.6)
  Top 0.305: IC1.8 v87.63,85.09 | v143.51,87 142.88,86.36 142.88,80.64 143.51,80.01 143.51,77.47 148.59,72.39 153.67,72.39 EXP.A8
  Bottom 0.305: v87.63,85.09 88.27,85.72 142.24,85.72 v143.51,87
AB4  (via drill 0.6)
  Top 0.305: IC1.11 v90.17,94.61 | EXP.A9 153.67,69.85 148.59,69.85 143.51,74.93 142.88,75.56 142.88,79.38 142.24,80.01 142.24,89.53 v140.97,90.81
  Bottom 0.305: v90.17,94.61 99.69,94.61 100.97,95.89 111.12,95.89 112.39,94.61 137.16,94.61 v140.97,90.81
AB5  (via drill 0.6)
  Top 0.305: v87.63,88.9 IC1.13 | EXP.A10 153.67,67.31 148.59,67.31 142.88,73.03 142.24,73.66 142.24,78.74 141.6,79.38 141.6,88.27 v139.06,90.81
  Bottom 0.305: v87.63,88.9 88.9,88.9 93.98,93.98 99.69,93.98 100.33,93.34 102.23,93.34 102.87,93.98 108.58,93.98 109.86,92.71 111.76,92.71 113.03,93.98 135.89,93.98 v139.06,90.81
AB6  (via drill 0.6)
  Top 0.305: v85.09,88.27 IC1.15 | v112.39,91.44 112.39,89.53 v111.76,88.9 | v137.16,90.81 140.97,87 140.97,78.74 141.6,78.11 141.6,71.75 148.59,64.77 153.67,64.77 EXP.A11
  Bottom 0.305: v85.09,88.27 85.72,87.63 98.42,87.63 100.33,89.53 104.14,89.53 105.41,88.27 111.12,88.27 v111.76,88.9 | v137.16,90.81 134.62,93.34 114.3,93.34 v112.39,91.44
AB7  (via drill 0.6)
  Top 0.305: v135.25,87 v135.25,62.23 | v82.55,85.72 IC1.17
  Bottom 0.305: v135.25,87 134.62,86.36 83.19,86.36 v82.55,85.72 | v135.25,62.23 153.67,62.23 EXP.A12
CLK1  (via drill 0.6)
  Top 0.305: v71.75,18.41 71.12,19.05 71.12,45.72 71.75,46.35 71.75,62.23 73.03,63.5 73.03,71.75 73.66,72.39 73.66,74.93 v73.03,75.56 | IC12.1 59.69,77.47 58.42,77.47 57.78,78.11 v57.78,78.74
  Bottom 0.305: EXP.A29 153.67,19.05 148.59,19.05 147.96,19.68 89.53,19.68 88.27,18.41 v71.75,18.41 | v73.03,75.56 68.58,75.56 66.04,78.11 58.42,78.11 v57.78,78.74
CLKEN  (via drill 0.6, 0.71)
  Top 0.305: v38.1,92.08 37.47,91.44 37.47,79.38 v38.1,78.74 | v42.55,80.64 IC14.3
  Bottom 0.305: 19.05,93.34 P5.2 | 19.05,93.34 19.68,92.71 31.11,92.71 31.75,92.08 v38.1,92.08 | v38.1,78.74 40.64,78.74 v42.55,80.64 | TP6.TP 11.43,93.98 12.7,92.71 18.41,92.71 19.05,93.34
DB0  (via drill 0.6)
  Top 0.305: v115.57,40.01 115.57,38.1 116.84,36.83 IC5.18 116.84,33.66 121.92,28.57 131.44,28.57 133.35,26.67 IC7.2 | v137.16,78.74 136.53,78.11 136.53,60.96 128.27,52.7 127.64,52.7 v126.36,51.44
  Bottom 0.305: v115.57,40.01 IC9.18 115.57,50.16 116.2,50.8 125.73,50.8 v126.36,51.44 | v137.16,78.74 EXP.C5
DB1  (via drill 0.6)
  Top 0.305: v116.84,38.73 116.84,38.1 118.11,36.83 IC5.17 118.11,33.66 122.56,29.21 132.08,29.21 134.62,26.67 IC7.3 | v137.79,76.2 137.16,75.56 137.16,60.33 137.16,59.69 128.91,51.44 v128.27,51.44
  Bottom 0.305: v116.84,38.73 IC9.17 116.84,49.53 117.47,50.16 127,50.16 v128.27,51.44 | v137.79,76.2 EXP.C6
DB2  (via drill 0.6)
  Top 0.305: v118.11,40.01 118.11,38.1 119.38,36.83 IC5.16 119.38,33.66 123.19,29.84 132.72,29.84 135.89,26.67 IC7.4 | v138.43,73.66 137.79,73.03 137.79,58.42 v129.54,50.16
  Bottom 0.305: v118.11,40.01 IC9.16 118.11,48.9 118.75,49.53 128.91,49.53 v129.54,50.16 | v138.43,73.66 EXP.C7
DB3  (via drill 0.6)
  Top 0.305: v119.38,38.73 119.38,38.1 120.65,36.83 IC5.15 120.65,33.66 123.83,30.48 133.35,30.48 137.16,26.67 IC7.5 | v131.44,50.16 138.43,57.15 138.43,70.48 v139.06,71.12
  Bottom 0.305: v119.38,38.73 IC9.15 119.38,48.26 120.02,48.9 130.18,48.9 v131.44,50.16 | v139.06,71.12 EXP.C8
DB4  (via drill 0.6)
  Top 0.305: v120.65,40.01 120.65,38.1 121.92,36.83 IC5.14 121.92,33.66 124.46,31.11 133.99,31.11 138.43,26.67 IC7.6 | v133.35,50.16 139.06,55.88 139.06,67.94 v139.7,68.58
  Bottom 0.305: v120.65,40.01 IC9.14 120.65,47.62 121.28,48.26 131.44,48.26 v133.35,50.16 | v139.7,68.58 EXP.C9
DB5  (via drill 0.6)
  Top 0.305: v121.92,38.73 121.92,38.1 123.19,36.83 IC5.13 123.19,33.66 125.09,31.75 134.62,31.75 139.7,26.67 IC7.7 | v135.25,50.16 139.7,54.61 139.7,65.41 v140.34,66.04
  Bottom 0.305: v121.92,38.73 IC9.13 121.92,46.99 122.56,47.62 132.72,47.62 v135.25,50.16 | v140.34,66.04 EXP.C10
DB6  (via drill 0.6)
  Top 0.305: v123.19,40.01 123.19,38.1 124.46,36.83 IC5.12 124.46,33.66 125.73,32.38 135.25,32.38 140.97,26.67 IC7.8 | v137.16,50.16 140.34,53.34 140.34,62.87 v140.97,63.5
  Bottom 0.305: v123.19,40.01 IC9.12 123.19,46.35 123.83,46.99 133.99,46.99 v137.16,50.16 | v140.97,63.5 EXP.C11
DB7  (via drill 0.6)
  Top 0.305: v124.46,38.73 124.46,38.1 125.73,36.83 IC5.11 125.73,33.66 126.36,33.02 135.89,33.02 142.24,26.67 IC7.9 | v141.6,60.96 140.97,60.33 140.97,52.07 v139.06,50.16
  Bottom 0.305: v124.46,38.73 IC9.11 124.46,45.72 125.09,46.35 135.25,46.35 v139.06,50.16 | v141.6,60.96 EXP.C12
DB8  (via drill 0.6)
  Top 0.305: IC8.2 80.01,31.11 v81.28,32.38 81.92,33.02 98.42,33.02 99.06,33.66 IC6.18 99.06,36.83 100.33,38.1 v100.33,40.01
  Bottom 0.305: v100.33,40.01 IC10.18 | EXP.C21 148.59,36.83 148.59,35.56 146.69,33.66 146.69,31.11 146.05,30.48 89.53,30.48 87,33.02 81.92,33.02 v81.28,32.38
DB9  (via drill 0.6)
  Top 0.305: v101.6,38.73 101.6,38.1 100.33,36.83 IC6.17 100.33,33.66 99.06,32.38 83.19,32.38 v81.28,30.48 IC8.3 81.28,24.13
  Bottom 0.305: v101.6,38.73 IC10.17 | EXP.C22 147.32,33.02 147.32,30.48 146.69,29.84 88.9,29.84 86.36,32.38 83.19,32.38 v81.28,30.48
DB10  (via drill 0.6)
  Top 0.305: IC8.4 82.55,29.84 v83.82,31.11 84.45,31.75 99.69,31.75 101.6,33.66 IC6.16 101.6,36.83 102.87,38.1 v102.87,40.01
  Bottom 0.305: v102.87,40.01 IC10.16 | EXP.C23 147.96,31.11 147.96,29.84 147.32,29.21 88.27,29.21 85.72,31.75 84.45,31.75 v83.82,31.11
DB11  (via drill 0.6)
  Top 0.305: IC8.5 v83.82,29.21 85.72,31.11 100.33,31.11 102.87,33.66 IC6.15 102.87,36.83 104.14,38.1 v104.14,38.73
  Bottom 0.305: v104.14,38.73 IC10.15 | EXP.C24 147.96,28.57 84.45,28.57 v83.82,29.21
DB12  (via drill 0.6)
  Top 0.305: IC8.6 v85.09,27.3 85.09,28.57 87,30.48 100.97,30.48 104.14,33.66 IC6.14 104.14,36.83 105.41,38.1 v105.41,40.01
  Bottom 0.305: v105.41,40.01 IC10.14 | v85.09,27.3 85.72,27.94 EXP.C25
DB13  (via drill 0.6)
  Top 0.305: v106.68,38.73 106.68,38.1 105.41,36.83 IC6.13 105.41,33.66 101.6,29.84 88.27,29.84 86.36,27.94 IC8.7 v86.36,20.95
  Bottom 0.305: v106.68,38.73 IC10.13 | EXP.C26 147.96,23.5 147.96,22.23 147.32,21.59 91.44,21.59 90.17,22.86 87.63,22.86 86.36,21.59 v86.36,20.95
DB14  (via drill 0.6)
  Top 0.305: v107.95,40.01 107.95,38.1 106.68,36.83 IC6.12 106.68,33.66 102.23,29.21 89.53,29.21 87.63,27.3 IC8.8 v87.63,19.68
  Bottom 0.305: v107.95,40.01 IC10.12 | EXP.C27 147.96,20.95 90.81,20.95 89.53,22.23 88.27,22.23 87.63,21.59 v87.63,19.68
DB15  (via drill 0.6)
  Top 0.305: v109.22,38.73 109.22,38.1 107.95,36.83 IC6.11 107.95,33.66 102.87,28.57 90.81,28.57 88.9,26.67 IC8.9 v88.9,20.95
  Bottom 0.305: v109.22,38.73 IC10.11 | EXP.C28 89.53,20.32 v88.9,20.95
FETCH  (via drill 0.6)
  Top 0.305: IC11.9 66.04,55.88 64.77,55.88 IC11.10 64.77,52.07 64.14,51.44 v63.5,51.44 62.87,51.44 62.23,52.07 IC11.12 | P5.3 21.59,92.08 v20.95,91.44 | v12.06,90.81 9.53,88.27 v9.53,83.19 | v1.27,81.28 1.27,50.16 1.91,49.53 CON5.3
  Bottom 0.305: v63.5,51.44 62.87,50.8 43.81,50.8 43.18,51.44 30.48,51.44 29.21,52.7 15.24,52.7 14.61,53.34 12.7,53.34 11.43,52.07 11.43,51.44 9.53,49.53 RN5.4 CON5.3 | v20.95,91.44 12.7,91.44 v12.06,90.81 | v9.53,83.19 3.17,83.19 v1.27,81.28
GND  (via drill 0.6, 0.71)
  Top 0.305: IC1.3 81.28,81.92 | IC1.4 82.55,81.92 | IC1.5 83.82,81.92 | IC1.6 85.09,81.92 | IC1.7 86.36,81.92 | IC1.10 90.17,81.92 | 88.9,90.81 IC1.12 | C26.2 22.86,24.45 v22.86,22.86 IC17.14 | IC17.6 26.67,10.47 C27.2 | C28.2 41.91,24.45 IC18.14 | IC18.6 45.72,10.47 C29.2 | 27.94,77.47 IC19.7 27.94,80.01 v27.3,80.64 | IC12.8 68.58,77.47 | 67.31,62.87 IC2.7 v67.31,66.04 | IC11.7 67.31,48.26 v69.22,48.26 | 47.62,32.38 IC13.7 | IC20.7 67.31,13.34 67.94,12.7 v68.58,12.7 | IC22.12 42.55,55.88 | IC22.2 41.27,49.53 | IC8.10 90.17,24.13 v91.44,24.13 | IC6.10 107.95,24.13 | 132.08,24.13 IC7.1 | IC7.10 143.51,24.13 | IC8.1 78.74,24.13 v77.47,24.13 | IC4.8 125.09,84.45 | IC14.12 42.55,85.09 | IC14.4 43.81,79.38 | IC5.10 125.73,24.13
  Top 0.61: 106.68,85.09 IC3.8 v106.68,76.2 | IC14.13 v41.27,86.36 | 42.55,55.88 42.55,58.42 41.27,59.69 IC23.2 | v41.27,45.72 IC22.2 | IC15.7 28.57,48.26 v29.84,48.26 | IC22.9 46.35,59.05 47.62,60.33 IC23.7 | IC22.7 47.62,46.35 v46.99,45.72 | IC14.12 42.55,85.72 43.18,86.36 44.45,86.36 45.09,85.72 IC14.10 | v29.84,32.38 28.57,32.38 IC21.7 | IC18.8 48.26,13.97 48.9,13.34 v49.53,13.34 | v46.99,72.39 46.35,71.75 IC23.9 | C2.1 112.81,45.94 v112.39,46.35 | C1.1 97.58,45.94 v97.16,46.35 | 125.73,24.13 v127,24.13 | v130.81,24.13 132.08,24.13 | 143.51,24.13 v144.78,24.13 | 107.95,24.13 v109.22,24.13 | 90.17,83.19 90.17,81.92 v92.08,81.92 | IC23.13 41.27,71.75 | IC4.8 125.09,87 125.73,87.63 v127,87.63
  Top 1.016: v15.88,47.62 v15.88,55.24 | v29.84,48.26 30.48,48.9 30.48,53.34 v32.38,55.24 | IC14.7 47.62,76.2 v46.99,75.56 v46.99,72.39 | v113.03,55.88 v113.03,59.05 | v78.74,55.88 v78.74,59.05 | v142.24,54.61 v142.24,57.78 | v127.64,34.92 127.64,37.47 v126.36,38.73 | v92.08,81.92 v92.08,89.53 | v36.2,33.02 36.2,33.66 34.29,35.56 34.29,43.81 35.56,45.09 v35.56,46.35
  Bottom 0.305: v22.86,22.86 22.23,22.86 21.59,22.23 21.59,21.17 C10.1
  other vias: 41.91,17.78 46.99,17.78 27.94,17.78 67.94,81.28 27.94,66.67 46.99,36.83 68.58,33.66 22.86,66.67 34.29,38.73
  pour Bottom (isolate 0.61, rank 6, no thermals): 0,0 160.02,0 160.02,99.06 0,99.06
  pour Top (isolate 0.61, rank 5, no thermals): 81.28,94.61 88.9,94.61 90.81,91.44 90.81,81.92 90.17,81.92 90.17,82.55 78.74,82.55 78.74,85.09 80.64,87 80.64,93.98
  pour Top (isolate 0.61, rank 5, no thermals): 39.05,14.92 48.9,14.92 48.9,20.64 39.05,20.64
  pour Top (isolate 0.61, no thermals): 20.95,14.92 20.95,20.32 29.53,20.32 29.53,14.92
  pour Top (isolate 0.61, rank 5, no thermals): 60.33,83.82 60.33,78.11 68.9,78.11 68.9,83.82
  pour Top (isolate 0.61, rank 5, no thermals): 40.64,69.22 40.64,63.82 48.26,63.82 48.26,69.22
  pour Top (isolate 0.61, rank 5, no thermals): 40.64,54.61 40.64,49.21 47.94,49.21 47.94,54.61
  pour Top (isolate 0.61, rank 5, no thermals): 21.59,69.85 21.59,63.82 28.89,63.82 28.89,69.85
  pour Top (isolate 0.61, rank 5, no thermals): 40.64,39.05 40.64,33.34 47.94,33.34 47.94,39.05
  pour Top (isolate 0.61, rank 5, no thermals): 59.05,40.01 59.05,36.83 57.78,35.56 57.78,31.43 69.53,31.43 69.53,40.01
  pour Top (isolate 0.61, rank 5, no thermals): 40.64,84.45 40.64,78.42 47.94,78.42 47.94,84.45
  pour Top (isolate 0.61, rank 5, no thermals): 47.94,78.11 47.94,69.22 41.27,69.22 41.27,78.11
N$1
  Top 0.305: SW1.16 RN1.2 IC5.2
N$2
  Top 0.305: SW1.15 RN1.3 118.11,17.14 116.84,18.41 IC5.3
N$3
  Top 0.305: SW1.14 RN1.4 120.65,17.14 118.11,19.68 IC5.4
N$4
  Top 0.305: SW1.13 RN1.5 123.19,17.14 119.38,20.95 IC5.5
N$5
  Top 0.305: SW1.12 RN1.6 125.73,17.14 120.65,22.23 IC5.6
N$6
  Top 0.305: SW1.11 RN1.7 128.27,17.14 121.92,23.5 IC5.7
N$7
  Top 0.305: SW1.10 RN1.8 130.81,17.14 128.91,19.05 127.64,19.05 123.19,23.5 IC5.8
N$8
  Top 0.305: SW1.9 RN1.9 133.35,17.14 130.81,19.68 128.27,19.68 124.46,23.5 IC5.9
N$9
  Top 0.305: SW2.16 RN2.2 92.08,17.14 97.79,22.86 IC6.2
N$10
  Top 0.305: SW2.15 RN2.3 94.61,17.14 99.06,21.59 IC6.3
N$11
  Top 0.305: SW2.14 RN2.4 97.16,17.14 100.33,20.32 IC6.4
N$12
  Top 0.305: SW2.13 RN2.5 99.69,17.14 101.6,19.05 IC6.5
N$13
  Top 0.305: SW2.12 RN2.6 102.23,17.14 102.87,17.78 IC6.6
N$14
  Top 0.305: SW2.11 RN2.7 104.78,17.14 104.14,17.78 IC6.7
N$15
  Top 0.305: SW2.10 RN2.8 107.31,17.14 105.41,19.05 IC6.8
N$16
  Top 0.305: SW2.9 RN2.9 109.86,17.14 106.68,20.32 IC6.9
N$17  (via drill 0.6)
  Top 0.305: IC23.4 43.81,62.23 v44.45,61.59 | v71.75,64.14 71.12,63.5 71.12,46.99 70.48,46.35 70.48,27.3 67.41,24.23 67.41,20.95 IC20.8
  Bottom 0.305: v44.45,61.59 46.35,63.5 71.12,63.5 v71.75,64.14
N$18  (via drill 0.6)
  Top 0.305: v48.26,52.07 47.62,51.44 46.35,51.44 45.09,50.16 IC22.5 | v55.24,52.07 54.61,52.7 54.61,56.52 55.88,57.78 55.88,59.69 55.24,60.33 v55.24,60.96 | v28.57,59.05 27.3,60.33 IC16.6
  Bottom 0.305: v55.24,52.07 54.61,51.44 48.9,51.44 v48.26,52.07 | v55.24,60.96 54.61,61.59 48.9,61.59 46.35,59.05 v28.57,59.05
N$22  (via drill 0.6)
  Top 0.305: RN3.2 CON3.1 113.67,66.67 114.3,66.04 v114.3,54.56
  Bottom 0.305: IC9.2 v114.3,54.56
N$31  (via drill 0.6)
  Top 0.305: v102.87,87.63 IC3.5 | v121.28,87.63 IC4.5 | v80.01,88.27 IC1.19
  Bottom 0.305: v80.01,88.27 81.28,87 102.23,87 v102.87,87.63 103.5,87 120.65,87 v121.28,87.63
N$32  (via drill 0.6)
  Top 0.305: IC2.13 v60.96,73.03 | v72.39,73.03 71.75,73.66 71.75,80.01 72.39,80.64 72.39,94.61 v73.03,95.25 | v99.06,95.89 IC3.15
  Bottom 0.305: v60.96,73.03 61.59,72.39 71.75,72.39 v72.39,73.03 | v73.03,95.25 73.66,95.89 v99.06,95.89
N$39
  Top 0.305: IC11.3 62.23,48.26 63.5,48.26 IC11.4
N$42  (via drill 0.6)
  Top 0.305: IC11.13 v60.96,57.78 | v67.31,57.78 IC11.8
  Bottom 0.305: v60.96,57.78 61.59,58.42 66.67,58.42 v67.31,57.78
N$43  (via drill 0.6)
  Top 0.305: IC15.11 v24.77,57.78 | v54.61,58.42 53.98,59.05 53.98,61.59 52.07,63.5 52.07,71.12 53.34,72.39 53.34,73.66 52.7,74.3 52.7,79.38 v53.34,80.01 | v60.96,80.64 IC12.2
  Bottom 0.305: v24.77,57.78 25.4,57.15 29.84,57.15 30.48,57.78 53.98,57.78 v54.61,58.42 | v53.34,80.01 60.33,80.01 v60.96,80.64
N$44  (via drill 0.71)
  Top 0.305: IC11.11 63.5,57.15 69.22,62.87 69.22,66.04 69.85,66.67 v69.85,82.55 | v62.23,81.92 IC12.14
  Bottom 0.305: v69.85,82.55 62.87,82.55 v62.23,81.92
N$45  (via drill 0.6, 0.71)
  Top 0.305: v24.77,45.72 IC15.4 | v40.01,76.2 IC14.1 | v66.04,76.2 IC12.6 | v34.29,74.93 33.66,74.3 33.66,72.39 34.29,71.75 34.29,69.22 33.02,67.94 33.02,64.77 33.66,64.14 33.66,59.05 34.92,57.78 34.92,53.34 33.02,51.44 33.02,46.35 v32.38,45.72 31.75,45.09 31.75,34.29 v32.38,33.66 | v41.27,35.56 IC13.2
  Bottom 0.305: v32.38,45.72 v24.77,45.72 | v34.29,74.93 38.73,74.93 v40.01,76.2 41.91,76.2 43.18,77.47 64.77,77.47 v66.04,76.2 | v32.38,33.66 33.02,34.29 40.01,34.29 v41.27,35.56
N$46  (via drill 0.6, 0.71)
  Top 0.305: v26.04,46.99 IC15.5 | v42.55,30.48 IC13.3 | v43.81,81.92 41.91,81.92 41.27,81.28 IC14.2 v41.27,73.66 | v53.34,81.92 52.7,82.55 52.7,89.53 v53.34,90.17 | v68.58,88.27 IC12.9 | v34.92,73.03 34.92,68.58 33.66,67.31 33.66,65.41 34.29,64.77 34.29,59.69 35.56,58.42 35.56,52.7 34.29,51.44 v34.29,48.26 34.29,45.72 33.02,44.45 33.02,34.92 34.92,33.02 34.92,31.11 v35.56,30.48
  Bottom 0.305: v34.29,48.26 31.75,48.26 30.48,46.99 v26.04,46.99 | v43.81,81.92 v53.34,81.92 | v53.34,90.17 53.98,89.53 67.31,89.53 v68.58,88.27 | v35.56,30.48 36.2,29.84 41.91,29.84 v42.55,30.48 | v34.92,73.03 35.56,73.66 v41.27,73.66
N$47  (via drill 0.6)
  Top 0.305: v70.48,86.36 71.12,85.72 71.12,81.92 70.48,81.28 70.48,66.04 69.85,65.41 69.85,52.07 69.22,51.44 66.67,51.44 66.04,50.8 IC11.6 | v63.5,87 IC12.13
  Bottom 0.305: v70.48,86.36 69.85,87 v63.5,87
N$48
  Top 0.305: IC2.6 IC2.9
N$49
  Top 0.305: IC7.19 133.35,36.83 127.64,42.55 CON1.1
N$50
  Top 0.305: IC7.18 134.62,36.83 130.18,41.27 CON1.2
N$51
  Top 0.305: CON1.3 132.72,40.01 135.89,36.83 IC7.17
N$52
  Top 0.305: CON1.4 135.25,38.73 137.16,36.83 IC7.16
N$53
  Top 0.305: IC7.15 138.43,36.83 137.79,37.47 CON1.5
N$54
  Top 0.305: CON1.6 140.34,37.47 139.7,36.83 IC7.14
N$56
  Top 0.305: IC7.13 140.97,40.64 142.88,42.55 CON1.7
N$59
  Top 0.305: IC17.15 21.59,24.45 C26.1 R1.1
N$62
  Top 0.305: CON1.8 145.41,40.64 142.24,37.47 IC7.12
N$63
  Top 0.305: CON2.1 75.56,41.27 80.01,36.83 IC8.19
N$64
  Top 0.305: CON2.2 78.11,40.01 81.28,36.83 IC8.18
N$65
  Top 0.305: IC8.17 82.55,36.83 80.64,38.73 CON2.3
N$66
  Top 0.305: CON2.4 83.19,37.47 83.82,36.83 IC8.16
N$67
  Top 0.305: IC8.15 85.09,36.83 85.72,37.47 CON2.5
N$68
  Top 0.305: CON2.6 88.27,38.73 86.36,36.83 IC8.14
N$69
  Top 0.305: IC8.13 87.63,36.83 90.81,40.01 CON2.7
N$70
  Top 0.305: CON2.8 93.34,41.27 88.9,36.83 IC8.12
N$71  (via drill 0.6)
  Top 0.305: RN3.3 CON3.2 116.2,66.67 115.57,66.04 v115.57,55.88
  Bottom 0.305: IC9.3 v115.57,55.88
N$72  (via drill 0.6)
  Top 0.305: RN3.4 CON3.3 118.75,66.67 116.84,64.77 v116.84,54.56
  Bottom 0.305: IC9.4 v116.84,54.56
N$73  (via drill 0.6)
  Top 0.305: RN3.5 CON3.4 121.28,66.67 118.11,63.5 v118.11,55.83
  Bottom 0.305: IC9.5 v118.11,55.83
N$74  (via drill 0.6)
  Top 0.305: RN3.6 CON3.5 123.83,66.67 119.38,62.23 v119.38,54.56
  Bottom 0.305: IC9.6 v119.38,54.56
N$75  (via drill 0.6)
  Top 0.305: RN3.7 CON3.6 126.36,66.67 120.65,60.96 v120.65,55.88
  Bottom 0.305: IC9.7 v120.65,55.88
N$76  (via drill 0.6)
  Top 0.305: RN3.8 CON3.7 128.91,66.67 121.92,59.69 v121.92,54.56
  Bottom 0.305: IC9.8 v121.92,54.56
N$77  (via drill 0.6)
  Top 0.305: IC21.8 v28.57,41.27 | v48.9,41.91 48.9,27.3 v48.26,26.67 | v67.94,26.67 IC24.9
  Bottom 0.305: v28.57,41.27 30.48,43.18 37.47,43.18 38.1,42.55 48.26,42.55 v48.9,41.91 | v67.94,26.67 55.88,26.67 55.24,27.3 52.7,27.3 52.07,26.67 v48.26,26.67
N$78  (via drill 0.6)
  Top 0.305: RN3.9 CON3.8 131.44,66.67 123.19,58.42 v123.19,55.83
  Bottom 0.305: IC9.9 v123.19,55.83
N$79
  Top 0.305: IC17.7 27.94,10.47 C27.1 28.57,9.84 28.57,8.89 27.94,8.26 22.86,8.26 22.23,8.89 22.23,10.16 R2.1
N$80
  Top 0.305: IC18.15 40.64,24.45 C28.1 R3.1
N$81  (via drill 0.71)
  Top 0.305: R4.1 40.64,10.16 40.64,8.89 v41.27,8.26 | IC18.7 46.99,10.47 C29.1 47.62,9.84 47.62,8.89 v46.99,8.26
  Bottom 0.305: v41.27,8.26 41.91,7.62 46.35,7.62 v46.99,8.26
N$83  (via drill 0.71)
  Top 0.305: v59.05,25.4 IC24.2 | v53.98,9.53 53.34,10.16 53.34,25.4 v53.98,26.04 | v62.23,9.53 IC20.3
  Bottom 0.305: v53.98,26.04 58.42,26.04 v59.05,25.4 | v53.98,9.53 v62.23,9.53
N$84  (via drill 0.6)
  Top 0.305: RN4.2 CON4.1 90.81,67.31 99.06,59.05 v99.06,55.88 99.06,55.19
  Bottom 0.305: IC10.2 v99.06,55.88
N$85  (via drill 0.6)
  Top 0.305: RN4.3 CON4.2 93.34,67.31 100.33,60.33 v100.33,54.61
  Bottom 0.305: IC10.3 v100.33,54.61
N$86  (via drill 0.6)
  Top 0.305: RN4.4 CON4.3 95.89,67.31 101.6,61.59 v101.6,55.83
  Bottom 0.305: IC10.4 v101.6,55.83
N$87  (via drill 0.6)
  Top 0.305: RN4.5 CON4.4 98.42,67.31 102.87,62.87 v102.87,54.61
  Bottom 0.305: IC10.5 v102.87,54.61
N$88  (via drill 0.6)
  Top 0.305: RN4.6 CON4.5 100.97,67.94 104.14,64.77 v104.14,55.83
  Bottom 0.305: IC10.6 v104.14,55.83
N$89  (via drill 0.6)
  Top 0.305: RN4.7 CON4.6 103.5,67.31 105.41,65.41 v105.41,54.61
  Bottom 0.305: IC10.7 v105.41,54.61
N$90  (via drill 0.6)
  Top 0.305: RN4.8 CON4.7 106.05,66.67 106.68,66.04 v106.68,55.83
  Bottom 0.305: IC10.8 v106.68,55.83
N$91  (via drill 0.6)
  Top 0.305: RN4.9 CON4.8 108.58,66.67 107.95,66.04 v107.95,54.61
  Bottom 0.305: IC10.9 v107.95,54.61
N$316
  Top 0.305: IC20.11 63.5,22.86 62.87,23.5 62.87,26.04 61.59,27.3 IC24.4
N$317  (via drill 0.6)
  Top 0.305: IC21.11 v24.77,42.55 | v52.7,43.18 52.07,42.55 52.07,38.73 52.7,38.1 52.7,35.56 52.07,34.92 v52.07,33.66 | v62.87,33.66 IC24.5
  Bottom 0.305: v24.77,42.55 27.94,42.55 29.21,43.81 38.1,43.81 38.73,43.18 v52.7,43.18 | v52.07,33.66 53.34,32.38 61.59,32.38 v62.87,33.66
N$318  (via drill 0.71)
  Top 0.305: IC20.6 66.04,12.7 67.31,11.43 69.22,11.43 70.48,12.7 v70.48,17.14 | v64.14,24.13 IC24.6
  Bottom 0.305: v64.14,24.13 66.04,22.23 68.58,22.23 70.48,20.32 v70.48,17.14
N$319  (via drill 0.6)
  Top 0.305: IC21.6 27.3,34.29 27.94,34.92 29.21,34.92 v29.84,34.29 | v65.41,33.66 IC24.7
  Bottom 0.305: v29.84,34.29 30.48,34.92 38.73,34.92 40.64,36.83 42.55,36.83 44.45,34.92 52.7,34.92 53.98,33.66 60.96,33.66 62.23,34.92 64.14,34.92 v65.41,33.66
N$321  (via drill 0.6)
  Top 0.305: IC21.3 23.5,34.92 24.13,35.56 v26.67,35.56 | v60.33,34.92 IC24.3
  Bottom 0.305: v26.67,35.56 38.1,35.56 40.01,37.47 43.18,37.47 45.09,35.56 53.34,35.56 54.61,34.29 59.69,34.29 v60.33,34.92
POWEROK  (via drill 0.6)
  Top 0.305: v9.53,59.69 9.53,75.56 12.06,78.11 12.06,85.72 13.97,87.63 v13.97,90.17 | v60.96,88.27 IC12.15 | v26.67,90.17 P5.5
  Bottom 0.305: CON6.8 v9.53,59.69 | v13.97,90.17 14.61,89.53 26.04,89.53 v26.67,90.17 27.3,89.53 40.01,89.53 40.64,88.9 60.33,88.9 v60.96,88.27
RUN  (via drill 0.6)
  Top 0.305: v11.43,38.1 11.43,45.09 12.06,45.72 12.06,50.8 v13.34,52.07 | 28.57,55.24 28.57,55.88 | v28.57,51.44 IC15.8 28.57,55.24 | v46.35,52.7 43.81,50.16 IC22.4 | 28.57,55.24 v29.84,55.24
  Bottom 0.305: CON5.7 10.16,39.37 v11.43,38.1 | v13.34,52.07 27.94,52.07 v28.57,51.44 | v46.35,52.7 45.72,52.07 33.02,52.07 v29.84,55.24
STOP  (via drill 0.6)
  Top 0.305: v19.05,45.72 14.61,45.72 12.7,43.81 12.7,40.01 13.34,39.37 13.34,36.2 v13.97,35.56 | v22.23,46.99 22.86,46.99 23.5,47.62 IC15.3
  Bottom 0.305: v13.97,35.56 5.08,35.56 3.81,36.83 CON5.8 | v19.05,45.72 20.32,46.99 v22.23,46.99
VCC  (via drill 0.6, 0.71)
  Top 0.305: IC17.3 22.86,13.97 | IC18.11 45.85,20.98 | IC17.10 27.94,21.59 26.67,21.59 IC17.11 26.67,19.68 26.04,19.05 20.95,19.05 20.32,19.68 IC17.16
  Bottom 0.305: C8.2 v114.3,90.81 | 78.74,92.08 C15.2 78.74,92.39 v78.74,94.61 | v15.24,20.95 C10.2 | v36.83,20.95 C19.2 | C4.2 v38.73,85.09 | v55.24,41.27 C9.2 | v19.05,84.45 C23.2 | v37.47,69.85 C18.2 | v57.15,69.85 C14.2 | 97.79,91.22 arc90 C5.2 v95.89,90.81 | v37.47,53.98 38.73,53.98 39.37,53.34 C24.2 | v56.52,84.45 C6.2 | 38.73,39.37 C12.2 v36.83,39.37 | v18.41,69.85 C25.2 | v18.41,39.37 C22.2 | C17.2 20.64,56.84 v20.32,57.15 | v76.83,34.92 C7.2 | v57.15,55.24 C13.2 | v57.15,20.95 C20.2
  Bottom 0.61: v113.03,40.01 IC9.20 | v97.79,40.01 IC10.20 | C21.2 112.39,34.92 v111.76,34.29 | C16.2 v129.54,34.92 | C3.2 v93.98,34.92
  pour Top (isolate 0.61, rank 6, no thermals): 0,0 160.02,0 160.02,99.06 0,99.06

## Text on the board
Top: (c) 2012 AlexiosC
Bottom: (c) 2012 AlexiosC
tNames: CLKGEN | WUNIT | CLKEN | !CLKOREG | !HALTINSTR | http://www.bedroomlan.org/cft | !WIR | 8 | !WIO | !WMEM | !RMEM | !RIO | !WAC | 8 | 15 | 0 | 7 | Switch Reg HI | Switch Reg LO | !WADDR | !RDPSW | !RUN | !RSW | !STOP | FETCH | Output Reg HI | Output Reg LO | !STEP | !++ADDR | «!SWNHBT | (c) 2012 AlexiosC | «RUN | 8 | 15 | 0 | 7 | «STOP | !SWINHIBIT | !MC3 | CFT BUS REV J | CFT Front Panel Controller Rev A | Consult OS docs for settings | !MC2 | !MC0 | !MC1 | RUNIT/INC | 8 | 9 | A | B | C | D | E | F | 0 | 1 | 2 | 3 | 4 | 5 | 6 | 7